# Altium schematic sheet ИУ4.11.03.03.20.63.06.SchDoc
size 420 x 297 mm; CheckedBy: Гладких А.А.; Author: Захарова Д.В.
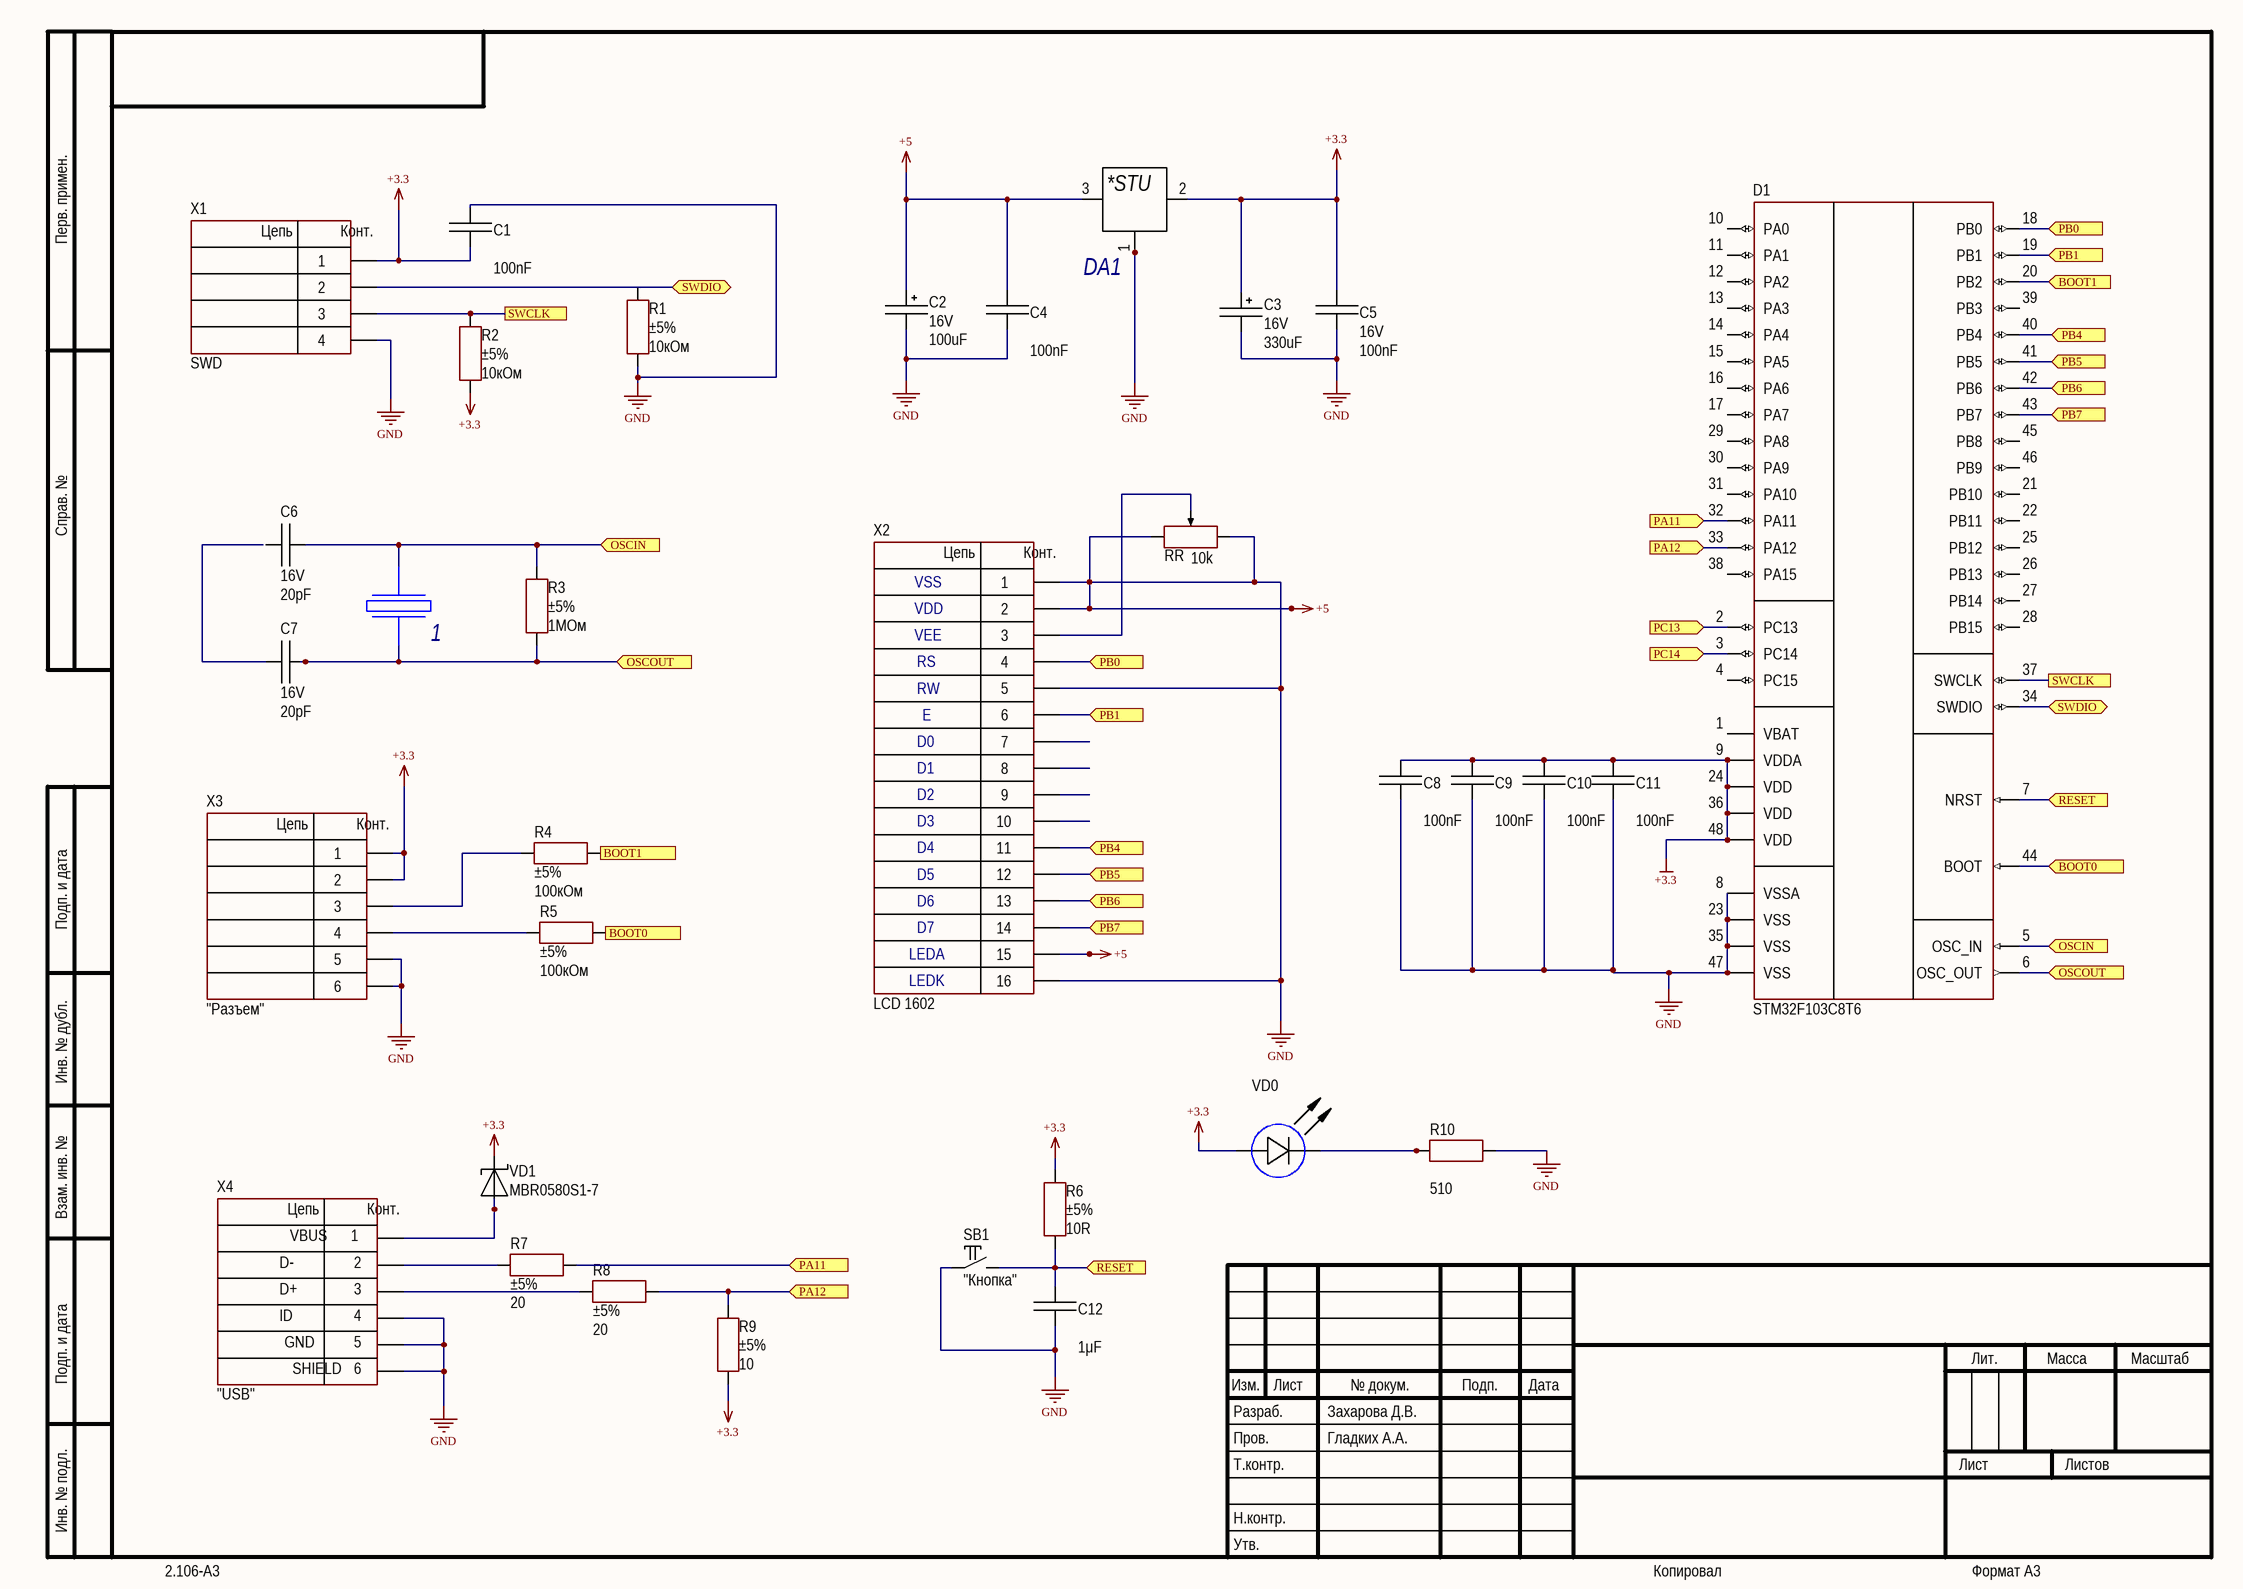
[diagram p0: ИУ4.11.03.03.20.63.06.SchDoc]

## Parts
1  Crystal  [HC-49SM]  (value not drawn)
C1  value 100nF  [CAP: 0805]
C2  value 100uF  Voltage: 16V  [CAP: TANTAL-D]
C3  value 330uF  Voltage: 16V  [CAP: 0603]
C4  value 100nF  [CAP: 0805]
C5  value 100nF  Voltage: 16V  [CAP: 0805]
C6  value 20pF  Voltage: 16V  [CAP: 0805]
C7  value 20pF  Voltage: 16V  [CAP: 0805]
C8  value 100nF  [CAP: 0805]
C9  value 100nF  [CAP: 0805]
C10  value 100nF  [CAP: 0805]
C11  value 100nF  [CAP: 0805]
C12  value 1μF  [CAP: 0805]
D1  (no value)  [48-LQFP]
DA1  LM1117-Series  [SOT-223]  (value not drawn)
R1  value 10кОм  Tolerance: ±5%  [RES: 0805]
R2  value 10кОм  Tolerance: ±5%  [RES: 0805]
R3  value 1МОм  Tolerance: ±5%  [RES: 0805]
R4  value 100кОм  Tolerance: ±5%  [RES: 0805]
R5  value 100кОм  Tolerance: ±5%  [RES: 0805]
R6  value 10R  Tolerance: ±5%  [RES: 0805]
R7  value 20  Tolerance: ±5%  [RES: 0805]
R8  value 20  Tolerance: ±5%  [RES: 0805]
R9  value 10  Tolerance: ±5%  [RES: 0805]
R10  value 510  [RES: 0805]
RR  value 10k  [RES: 3314G]
SB1  CommentText: "Кнопка"  [BUT: 6x6 SMD]
VD0  (no value)  [LED: 1206B]
VD1  PartNumber: MBR0580S1-7  [DIODE: SMA]
X1  CommentText: SWD  [CON: PLS-4]
X2  CommentText: LCD 1602  [CON: IDC-16MS]
X3  CommentText: "Разъем"  [CON: PLD-6]
X4  CommentText: "USB"  [CON: USB micro-A (ZX62-B-5PA)]

## Ports
BOOT0 (in), BOOT1 (in), OSCIN (in), OSCOUT (in), PA11 (in), PA12 (in), PB0 (in), PB1 (in), PB4 (in), PB5 (in), PB6 (in), PB7 (in), PC13 (in), PC14 (in), RESET (in), SWCLK, SWDIO (bidir)

## Nets
+3.3: C1.1 C3.1 C5.2 C8.2 C9.2 C10.2 C11.2 D1.9(VDDA) D1.24(VDD) D1.36(VDD) D1.48(VDD) DA1.2(Out) R2.1 R6.2 R9.1 VD0.1(A) VD1.2 X1.1 X3.1 X3.2
+5: C1.2 C2.1 C2.2 C3.2 C4.1 C4.2 C5.1 C8.1 C9.1 C10.1 C11.1 C12.1 D1.8(VSSA) D1.23(VSS) D1.35(VSS) D1.47(VSS) DA1.1(Adj/GND) DA1.3(In) R1.1 R10.1 RR.1 RR.3 SB1.1 X1.4 X2.1 X2.2 X2.5 X2.15 X2.16 X3.5 X3.6 X4.0 X4.4 X4.5  [also labelled GND]
BOOT0: D1.44(BOOT) R5.1 ; port BOOT0
BOOT1: D1.20(PB2) R4.1 ; port BOOT1
OSCIN: 1.3 C6.1 D1.5(OSC_IN) R3.2 ; port OSCIN
OSCOUT: 1.1 C7.1 D1.6(OSC_OUT) R3.1 ; port OSCOUT
PA11: D1.32(PA11) R7.2 ; port PA11
PA12: D1.33(PA12) R8.2 R9.2 ; port PA12
PB0: D1.18(PB0) X2.4 ; port PB0
PB1: D1.19(PB1) X2.6 ; port PB1
PB4: D1.40(PB4) X2.11 ; port PB4
PB5: D1.41(PB5) X2.12 ; port PB5
PB6: D1.42(PB6) X2.13 ; port PB6
PB7: D1.43(PB7) X2.14 ; port PB7
PC13: D1.2(PC13) ; port PC13
PC14: D1.3(PC14) ; port PC14
RESET: C12.2 D1.7(NRST) R6.1 SB1.2 ; port RESET
SWCLK: D1.37(SWCLK) R2.2 X1.3 ; port SWCLK
SWDIO: D1.34(SWDIO) R1.2 X1.2 ; port SWDIO
NetR4_2: R4.2 X3.3
NetR5_2: R5.2 X3.4
NetR7_1: R7.1 X4.2
NetR8_1: R8.1 X4.3
NetR10_2: R10.2 VD0.2(C)
NetRR_2: RR.2 X2.3
NetVD1_1: VD1.1 X4.1

Not connected (* = marked no-connect by the designer): C6 2; C7 2; D1 1(VBAT) 4(PC15) 10(PA0) 11(PA1) 12(PA2) 13(PA3) 14(PA4) 15(PA5) 16(PA6) 17(PA7) 21(PB10) 22(PB11) 25(PB12) 26(PB13) 27(PB14) 28(PB15) 29(PA8) 30(PA9) 31(PA10) 38(PA15) 39(PB3) 45(PB8) 46(PB9); X2 7 8 9 10

## Notes on the sheet
- VSS
- VDD
- VEE
- RS
- RW
- E
- D0
- D1
- D2
- D3
- D4
- D5
- D6
- D7
- LEDA
- LEDK
- Перв. примен.
- Справ. №
- Подп. и дата
- Инв. № дубл.
- Взам. инв. №
- Разраб.
- Изм.
- Лист
- № докум.
- Подп.
- Дата
- Лит.
- Масса
- Масштаб
- Пров.
- Т.контр.
- Листов
- Инв. № подл.
- Утв.
- Н.контр.
- 2.106-A3
- Копировал
- Формат А3
- (in symbol Connector_USB_micro_B) Цепь; Конт.; VBUS; D-; D+; ID; GND; SHIELD; 6
- (in symbol IDC-16) Цепь; Конт.
- (in symbol LM1117MPX-3.3) *STU
- (in symbol PLD-6) Цепь; Конт.
- (in symbol PLS-4) Цепь; Конт.

## Library data of the parts
1 = HC49SM-8.000MHz-20pF: ID: 17; Value: HC49S-8.000MHZ-20pF; Output Frequency: 8MHz; Load Capacitance: 20pF; Temperature Coefficient: ±50ppm; Application Category: 1; Published: 08.03.2013; Publisher: Andrew Danich; Type: Резонатор; Part Number: HC49SM-8.000MHz-20pF
C1 C4 C8-C11 = Ceramic_0805: Manufacturer: Yageo; PartNumber: CC0805KRX7R7BB104; ValueManufacturerPartNumber: Ceramic capacitor, 100nF, X7R, ±10%, 16V, 0805, -55...+125°C; TypeCapacitor: Ceramic capacitor; Tolerance: ±10%; TypeDielectric: X7R; Voltage: 16V; Package: 0805; HelpURL: https://www.digikey.com/product-detail/en/yageo/CC0805KRX7R7BB104/311-1142-1-ND/303052; Temperature: -55...+125°C
C2 = Tantal_D: Manufacturer: AVX; PartNumber: TAJD476M035RNJV; ValueManufacturerPartNumber: Tantalum capacitor, 100uF, 16V, ±20%, 900mOhm, case D (7343), -55...+125°C; Impedance: 900mOhm; Tolerance: ±20%; TypeDielectric: X7R; TypeCapacitor: Tantalum capacitor; Package: case D (7343); HelpURL: https://www.digikey.com/product-detail/en/avx-corporation/TAJD476M035RNJV/478-12122-1-ND/8605695; Temperature: -55...+125°C
C3 = Aluminium: Manufacturer: Wurth; PartNumber: 860080475013; ValueManufacturerPartNumber: Aluminium capacitor, 330uF, 16V, ±20%, 54mOhm, 14x10x5 mm, -55...+105°C; TypeCapacitor: Aluminium capacitor; Tolerance: ±20%; Impedance: 54mOhm; Package: 14x10x5 mm; HelpURL: https://www.digikey.com/product-detail/en/wurth-electronics-inc/860080475013/732-9029-1-ND/5728972; Temperature: -55...+105°C
C5 = Ceramic_0805: Manufacturer: Yageo; PartNumber: CC0805KRX7R7BB104; ValueManufacturerPartNumber: Ceramic capacitor, 100nF, X7R, ±10%, 16V, 0805, -55...+125°C; TypeCapacitor: Ceramic capacitor; Tolerance: ±10%; TypeDielectric: X7R; Package: 0805; HelpURL: https://www.digikey.com/product-detail/en/yageo/CC0805KRX7R7BB104/311-1142-1-ND/303052; Temperature: -55...+125°C
C6 C7 = Ceramic_0805: Manufacturer: Yageo; PartNumber: CC0805KRX7R7BB104; ValueManufacturerPartNumber: Ceramic capacitor, 20pF, X7R, ±10%, 16V, 0805, -55...+125°C; TypeCapacitor: Ceramic capacitor; Tolerance: ±10%; TypeDielectric: X7R; Package: 0805; HelpURL: https://www.digikey.com/product-detail/en/yageo/CC0805KRX7R7BB104/311-1142-1-ND/303052; Temperature: -55...+125°C
C12 = Ceramic_0805: Manufacturer: Yageo; PartNumber: CC0805KRX7R7BB104; ValueManufacturerPartNumber: Ceramic capacitor, 1μF, X7R, ±10%, 16V, 0805, -55...+125°C; TypeCapacitor: Ceramic capacitor; Tolerance: ±10%; TypeDielectric: X7R; Voltage: 16V; Package: 0805; HelpURL: https://www.digikey.com/product-detail/en/yageo/CC0805KRX7R7BB104/311-1142-1-ND/303052; Temperature: -55...+125°C
D1 = STM32F103C8T6: Cortex-M3; Manufacturer: STMicroelectronics; ValueManufacturerPartNumber: IC microcontroller, 32-Bit, Cortex-M3, 72MHz, 64KB, 20KB, 2...3.6V, -40...+85°C, 48-LQFP; Supply: 2...3.6V; Speed: 72MHz; CoreSize: 32-Bit; MemoryROM: 64KB; MemoryRAM: 20KB; HelpURL: https://www.digikey.com/product-detail/en/stmicroelectronics/STM32F103C8T6TR/497-17666-1-ND/7804402; Package: 48-LQFP; ComponentType: IC microcontroller; Temperature: -40...+85°C; CoreProcessor: Cortex-M3; PartNumber: STM32F103C8T6
DA1 = LM1117MPX-3.3: ID: 9; Input Voltage: +8.5…20V; Output Current: 800mA; Output Voltage: +3.3V; Published: 13.08.2015; Publisher: Andrew Danich; Type: Микросхема; Part Number: LM1117MPX-3.3; Value: LM1117MPX-3.3
R1 R2 = Resistor_0805: Manufacturer: Yageo; PartNumber: RC0805JR-07100RL; ValueManufacturerPartNumber: Resistor film, 10кОм, ±5%, 0805, 0.125W, -55...+125°C; TypeResistor: Resistor film; Power: 0.125W; Package: 0805; HelpURL: https://www.digikey.com/product-detail/en/yageo/RC0805JR-07100RL/311-100ARCT-ND/731185; Temperature: -55...+125°C
R3 = Resistor_0805: Manufacturer: Yageo; PartNumber: RC0805JR-07100RL; ValueManufacturerPartNumber: Resistor film, 1МОм, ±5%, 0805, 0.125W, -55...+125°C; TypeResistor: Resistor film; Power: 0.125W; Package: 0805; HelpURL: https://www.digikey.com/product-detail/en/yageo/RC0805JR-07100RL/311-100ARCT-ND/731185; Temperature: -55...+125°C
R4 R5 = Resistor_0805: Manufacturer: Yageo; PartNumber: RC0805JR-07100RL; ValueManufacturerPartNumber: Resistor film, 100кОм, ±5%, 0805, 0.125W, -55...+125°C; TypeResistor: Resistor film; Power: 0.125W; Package: 0805; HelpURL: https://www.digikey.com/product-detail/en/yageo/RC0805JR-07100RL/311-100ARCT-ND/731185; Temperature: -55...+125°C
R6 = Resistor_0805: Manufacturer: Yageo; PartNumber: RC0805JR-07100RL; ValueManufacturerPartNumber: Resistor film, 10R, ±5%, 0805, 0.125W, -55...+125°C; TypeResistor: Resistor film; Power: 0.125W; Package: 0805; HelpURL: https://www.digikey.com/product-detail/en/yageo/RC0805JR-07100RL/311-100ARCT-ND/731185; Temperature: -55...+125°C
R7 R8 = Resistor_0805: Manufacturer: Yageo; PartNumber: RC0805JR-07100RL; ValueManufacturerPartNumber: Resistor film, 20, ±5%, 0805, 0.125W, -55...+125°C; TypeResistor: Resistor film; Power: 0.125W; Package: 0805; HelpURL: https://www.digikey.com/product-detail/en/yageo/RC0805JR-07100RL/311-100ARCT-ND/731185; Temperature: -55...+125°C
R9 = Resistor_0805: Manufacturer: Yageo; PartNumber: RC0805JR-07100RL; ValueManufacturerPartNumber: Resistor film, 10, ±5%, 0805, 0.125W, -55...+125°C; TypeResistor: Resistor film; Power: 0.125W; Package: 0805; HelpURL: https://www.digikey.com/product-detail/en/yageo/RC0805JR-07100RL/311-100ARCT-ND/731185; Temperature: -55...+125°C
R10 = Resistor_0805: Manufacturer: Yageo; PartNumber: RC0805JR-07100RL; ValueManufacturerPartNumber: Resistor film, 510, ±5%, 0805, 0.125W, -55...+125°C; TypeResistor: Resistor film; Power: 0.125W; Tolerance: ±5%; Package: 0805; HelpURL: https://www.digikey.com/product-detail/en/yageo/RC0805JR-07100RL/311-100ARCT-ND/731185; Temperature: -55...+125°C
RR = Trimmer: Manufacturer: Bourns; PartNumber: 3296W-1-103LF; ValueManufacturerPartNumber: Resistor film, 10k, ±10%, 3296W, 0.5W, -55...+125°C; TypeResistor: Resistor film; Power: 0.5W; Tolerance: ±10%; Package: 3296W; HelpURL: https://www.digikey.com/product-detail/en/bourns-inc/3296W-1-103LF/3296W-103LF-ND/1088045; Temperature: -55...+125°C
SB1 = Button_tactile: Manufacturer: TE Connectivity; ValueManufacturerPartNumber: Tactile button, 6x6mm; PartNumber: FSM2JSMAATR; TypeButton: Tactile button; HelpURL: https://www.digikey.com/product-detail/en/te-connectivity-alcoswitch-switches/FSM2JSMAATR/450-1792-1-ND/3503931; Package: 6x6mm
VD0 = LED_single: ValueManufacturerPartNumber: LED, Green, *, *, *, -55...+150°C; TypeDiode: LED; ColorParameter: Green; Manufacturer: *; Package: *; HelpURL: *; Temperature: -55...+150°C; Current: *; VoltageDrop: *; PartNumber: *; Color: GREEN
VD1 = Schottky_single: Manufacturer: Diodes Incorporated; ValueManufacturerPartNumber: Schottky diode, 80V, 500mA, 1V, 15pF, SOD-123, -55...+150°C; TypeDiode: Schottky diode; Voltage: 80V; Current: 500mA; VoltageDrop: 1V; RecoveryTime: 15pF; Package: SOD-123; HelpURL: https://www.digikey.com/product-detail/en/diodes-incorporated/MBR0580S1-7/MBR0580S1-7DICT-ND/5080371; Temperature: -55...+150°C
X1 = PLS-4: Manufacturer: Connfly; ValueManufacturerPartNumber: Connector, 4pin, 2.54mm, 500VAC, 3A; TypeConnector: Connector; VoltageMax: 500VAC; Pitch: 2.54mm; CurrentMax: 3A; Multichannel: 4pin; HelpURL: https://www.chipdip.ru/product/pls-4; PartNumber: PLS-4
X2 = IDC-16: Manufacturer: Connfly; ValueManufacturerPartNumber: Connector, 16pin, 2.54mm, 250VAC, 3A; TypeConnector: Connector; VoltageMax: 250VAC; Pitch: 2.54mm; CurrentMax: 3A; Multichannel: 16pin; HelpURL: https://www.chipdip.ru/product/idc-16ms; PartNumber: IDC-16
X3 = PLD-6: Manufacturer: Connfly; ValueManufacturerPartNumber: Connector, 6pin, 2.54mm, 500VAC, 3A; TypeConnector: Connector; VoltageMax: 500VAC; Pitch: 2.54mm; CurrentMax: 3A; Multichannel: 6pin; HelpURL: https://www.chipdip.ru/product/pld-6; PartNumber: PLD-6
X4 = Connector_USB_micro_B: Manufacturer: Hirose Electric; ValueManufacturerPartNumber: USB micro B; PartNumber: ZX62-B-5PA; HelpURL: https://www.digikey.com/product-detail/en/hirose-electric-co-ltd/ZX62-B-5PA/H11579CT-ND/1851090; TypeConnector: USB micro B